# Altium schematic sheet P1.schdoc
size 297 x 209 mm; Symbol: Drawing-Symbol_A4; Company: 嘉立创EDA; Version: V1.0; Page Size: A4; @Project Name: Watcher; @Update Date: 2026-03-18; @Create Date: 2026-03-18; Device: Drawing-Symbol_A4; @Board Name: Board1; @Page Name: P1; @Create Time: 16:12:07; @Page Count: 1; @Page No: 1; @Schematic Name: Schematic6; @Update Time: 16:12:07; @Assembly Variant: Basic; Border: 1; Title Block Position: 3; Size: A4; Width: 1170; Height: 825; Region Start: 1; X Region Count: 6; Y Region Count: 4; Blade Width: 10; Title Block: 1
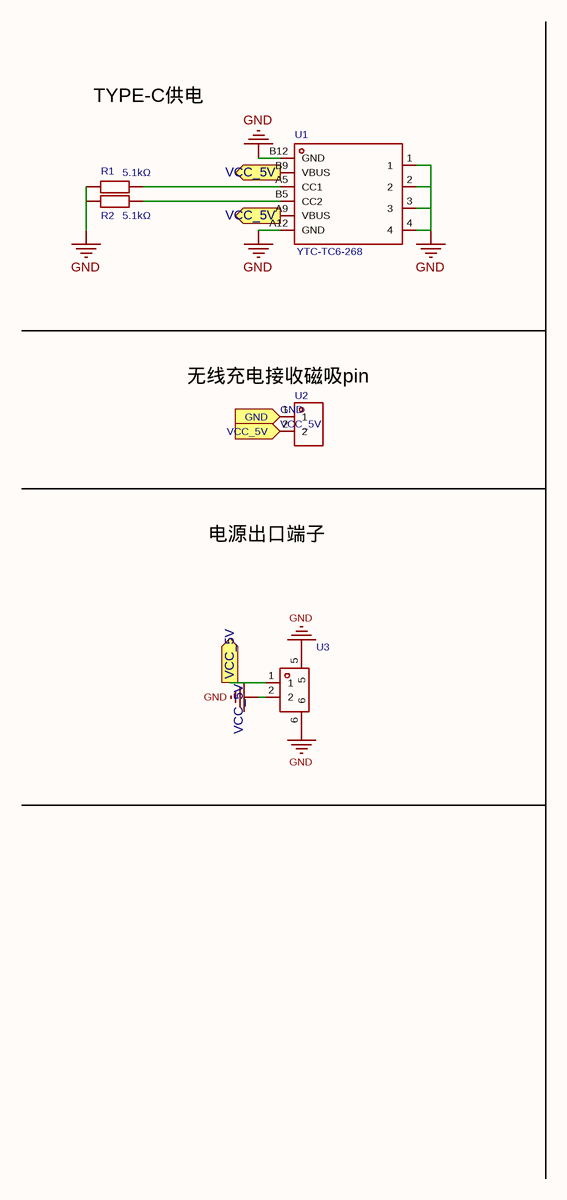
[diagram p0: P1.schdoc]

## Parts
R1  5.1kΩ  [R0603_1]
R2  5.1kΩ  [R0603_1]
U1  YTC-TC6-268  [TYPE-C-SMD_YIYUAN_YTC-TC6-268]
U2  PR5L4015-2P-C-F  [CONN-TH_PR5L4015-2P-C-F]  (value not drawn)
U3  1.0WT-2P  [CONN-SMD_2P-P1.00-WT]  (value not drawn)

## Ports
GND (in), VCC_5V (in), VCC_5V (out)

## Nets
GND: R1.1 R2.1 U1.1 U1.2 U1.3 U1.4 U1.A12(GND) U1.B12(GND) U2.1 U3.2 U3.5 U3.6 ; port GND
VCC_5V: U1.A9(VBUS) U1.B9(VBUS) U2.2 U3.1 ; port VCC_5V
NetR1_2: R1.2 U1.A5(CC1)
NetR2_2: R2.2 U1.B5(CC2)

## Notes on the sheet
- TYPE-C供电
- (near U2) 无线充电接收磁吸pin
- 电源出口端子
- 1
- 2
- 3
- 4
- 5
- 6
- A
- B
- C
- 创建日期
- 2026-03-18
- 原理图
- 板子
- Schematic6
- Board1
- 更新日期
- 图页
- P1
- D
- 绘制
- 审阅
- Watcher
- 版本
- V1.0
- 尺寸
- A4
- 页    1    共    1
- 嘉立创EDA

## Library data of the parts
R1 R2 = 0603WAF5101T5E: 电阻类型:厚膜电阻;阻值:5.1kΩ;精度:±1%;功率:100mW;温度系数:±100ppm/;最大工作电压:75V;工作温度范围:-55~+155;; Manufacturer: UNI-ROYAL(厚声); Symbol: 0603WAF5101T5E_2; 3D Model: 6bd5cd867e9542ebae21caaf5d2d4c4d; 3D Model Transform: 31.8897,63.7794,0,90,0,0,0,0,0; Tolerance: ±1%; Power(Watts): 100mW; Overload Voltage (Max): 75V; AddInBom: yes; ModelName: R0603; Device: 0603WAF5101T5E; Temperature Coefficient: ±100ppm/; Operating Temperature Range: -55~+155; LCSC Part Name: 5.1kΩ ±1% 100mW; Supplier Part: C23186; Manufacturer Part: 0603WAF5101T5E; Supplier Footprint: 0603; JLCPCB Part Class: 基础库; Datasheet: https://atta.szlcsc.com/upload/public/pdf/source/20200306/C422600_1E6D84923E4A46A82E41ADD87F860B5C.pdf; Supplier: LCSC; Type: 厚膜电阻; Value: 5.1kΩ; ConvertToPcb: yes; FootprintName: R0603_1
U1 = YTC-TC6-268: 连接器类型:Type-C;公母:母座;触点数量:6;; Manufacturer: YIYUAN(怡远); 3D Model: 1d7009b8f1724e38b5608beb74744d7c; 3D Model Transform: 351.9678,271.653,0,0,0,0,0,-49.21,-39.37; Connector Type: Type-C; Gender: 母座; Number of Contacts: 6; AddInBom: yes; Symbol: YTC-TC6-268; Device: YTC-TC6-268; LCSC Part Name: Type-C 母座; Supplier Part: C5260484; Manufacturer Part: YTC-TC6-268; Supplier Footprint: SMD; JLCPCB Part Class: 扩展库; Datasheet: https://atta.szlcsc.com/upload/public/pdf/source/20221115/94102468E8C367463F1D717839C68408.pdf; Supplier: LCSC; ConvertToPcb: yes; FootprintName: TYPE-C-SMD_YIYUAN_YTC-TC6-268; ModelName: TYPE-C-SMD_YIYUAN_YTC-TC6-268
U2 = PR5L4015-2P-C-F: 类型:弹簧顶针(POGO PIN);总PIN数:2P;间距:2.54mm;全长/全高:-;工作高度:-;接触电阻:-;弹性寿命:10000次;额定电流:2A;额定电压:12V;触头材质:黄铜;触头镀层:金;工作温度:-40℃~+85℃;; Manufacturer: SAMZO(三佐); AddInBom: yes; ModelId: b90aeb6b96e24f01ad23ec9df1f310720819f05c4eef4c71ace90d822a990e87; ModelTransform: 570.865,157.8737,0,0,0,0,-0.002,0,-59.055; Pitch: 2.54mm; Elastic Life: 10000次; Current Rating: 2A; Voltage Rating: 12V; Symbol: PR5L4015-2P-C-F; Device: PR5L4015-2P-C-F; LCSC Part Name: 2.54-2P磁吸弹簧探针连接器母座POGOPIN适配PR5L5015-2P-C-H; SupplierPart: C41361288; ManufacturerPart: PR5L4015-2P-C-F; Supplier Footprint: -; JLCPCB Part Class: Extended Part; Datasheet: https://item.szlcsc.com/datasheet/PR5L4015-2P-C-F/43105439.html; Supplier: LCSC; ConvertToPcb: yes; FootprintName: CONN-TH_PR5L4015-2P-C-F; ModelName: CONN-TH_PR5L4015-2P-C-F; Type: 弹簧顶针(POGO PIN); Number of Pins: 2P; Overall Length/Height: -; Operational Height: -; Contact Resistance: -; Contact Material: 黄铜; Contact Plating: 金; Operating Temperature: -40℃~+85℃
U3 = 1.0WT-2P: AddInBom: yes; ModelId: 0482cc1e6c6742feac0b73b7110cbf730819f05c4eef4c71ace90d822a990e87; ModelName: CONN-SMD_SH1.00-WS-2P_1; ModelTransform: 137.795,196.85,0,0,0,0,0,-5.906,0; Symbol: 1.0WT-2P; Device: 1.0WT-2P; LCSC Part Name: 1.0WT-2P; SupplierPart: C2802563; ManufacturerPart: 1.0WT-2P; Supplier Footprint: SH1.0; JLCPCB Part Class: Extended Part; Supplier: LCSC; ConvertToPcb: yes; FootprintName: CONN-SMD_2P-P1.00-WT